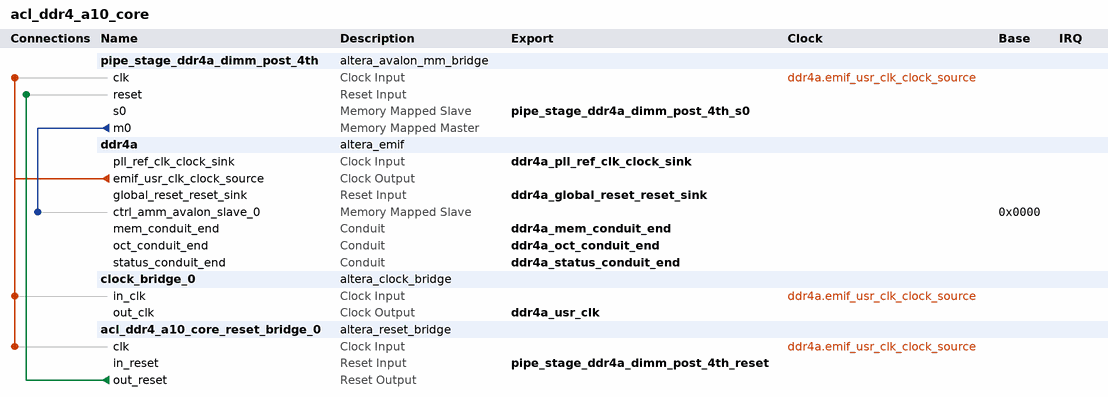
[diagram p0: system contents]
# Platform Designer (Qsys) system acl_ddr4_a10_core, Arria 10 10AX115S2F45I1SG
# Parameters at their usual value, and those the tool derives, are not listed.
package require -exact qsys 1.0
create_system acl_ddr4_a10_core
set_project_property DEVICE_FAMILY {Arria 10}
set_project_property DEVICE 10AX115S2F45I1SG

add_component pipe_stage_ddr4a_dimm_post_4th ip/acl_ddr4_a10_core/acl_ddr4_a10_core_pipe_stage_ddr4a_dimm_post_4th.ip altera_avalon_mm_bridge pipe_stage_ddr4a_dimm_post_4th 16.1
load_component pipe_stage_ddr4a_dimm_post_4th
set_component_parameter_value DATA_WIDTH 512
set_component_parameter_value ADDRESS_WIDTH 31
set_component_parameter_value USE_AUTO_ADDRESS_WIDTH 0
set_component_parameter_value ADDRESS_UNITS SYMBOLS
set_component_parameter_value MAX_BURST_SIZE 16
set_component_parameter_value MAX_PENDING_RESPONSES 32
save_component

add_component ddr4a ip/acl_ddr4_a10_core/acl_ddr4_a10_core_ddr4a.ip altera_emif ddr4a 16.1

add_component clock_bridge_0 ip/acl_ddr4_a10_core/acl_ddr4_a10_core_clock_bridge_0.ip altera_clock_bridge clock_bridge_0 16.1

add_component acl_ddr4_a10_core_reset_bridge_0 ip/acl_ddr4_a10_core/acl_ddr4_a10_core_reset_bridge_0.ip altera_reset_bridge acl_ddr4_a10_core_reset_bridge_0 16.1
load_component acl_ddr4_a10_core_reset_bridge_0
set_component_parameter_value ACTIVE_LOW_RESET 0
set_component_parameter_value SYNCHRONOUS_EDGES deassert
save_component

# connections
add_connection ddr4a.emif_usr_clk_clock_source acl_ddr4_a10_core_reset_bridge_0.clk clock
add_connection ddr4a.emif_usr_clk_clock_source clock_bridge_0.in_clk clock
add_connection ddr4a.emif_usr_clk_clock_source pipe_stage_ddr4a_dimm_post_4th.clk clock
add_connection acl_ddr4_a10_core_reset_bridge_0.out_reset pipe_stage_ddr4a_dimm_post_4th.reset reset
add_connection pipe_stage_ddr4a_dimm_post_4th.m0 ddr4a.ctrl_amm_avalon_slave_0 avalon
set_connection_parameter_value pipe_stage_ddr4a_dimm_post_4th.m0/ddr4a.ctrl_amm_avalon_slave_0 baseAddress 0x0000

# exported interfaces
add_interface ddr4a_global_reset_reset_sink reset sink
set_interface_property ddr4a_global_reset_reset_sink EXPORT_OF ddr4a.global_reset_reset_sink
add_interface ddr4a_mem_conduit_end conduit end
set_interface_property ddr4a_mem_conduit_end EXPORT_OF ddr4a.mem_conduit_end
add_interface ddr4a_oct_conduit_end conduit end
set_interface_property ddr4a_oct_conduit_end EXPORT_OF ddr4a.oct_conduit_end
add_interface ddr4a_pll_ref_clk_clock_sink clock sink
set_interface_property ddr4a_pll_ref_clk_clock_sink EXPORT_OF ddr4a.pll_ref_clk_clock_sink
add_interface ddr4a_status_conduit_end conduit end
set_interface_property ddr4a_status_conduit_end EXPORT_OF ddr4a.status_conduit_end
add_interface ddr4a_usr_clk clock source
set_interface_property ddr4a_usr_clk EXPORT_OF clock_bridge_0.out_clk
add_interface pipe_stage_ddr4a_dimm_post_4th_reset reset sink
set_interface_property pipe_stage_ddr4a_dimm_post_4th_reset EXPORT_OF acl_ddr4_a10_core_reset_bridge_0.in_reset
add_interface pipe_stage_ddr4a_dimm_post_4th_s0 avalon slave
set_interface_property pipe_stage_ddr4a_dimm_post_4th_s0 EXPORT_OF pipe_stage_ddr4a_dimm_post_4th.s0

set_interconnect_requirement {$system} qsys_mm.clockCrossingAdapter HANDSHAKE
set_interconnect_requirement {$system} qsys_mm.enableEccProtection FALSE
set_interconnect_requirement {$system} qsys_mm.insertDefaultSlave FALSE
set_interconnect_requirement {$system} qsys_mm.maxAdditionalLatency 1

save_system acl_ddr4_a10_core.qsys
